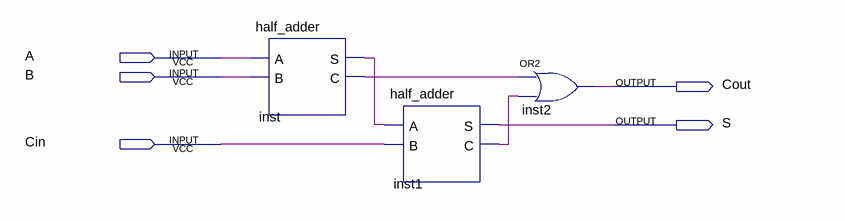
[diagram p0: schematic sheet]
// Quartus schematic full_adder.bdf as structural Verilog: 3 symbols, 5 pins
module full_adder (
  input  A,
  input  B,
  input  Cin,
  output Cout,
  output S
);

  wire inst1_c, inst_c, inst_s;

  half_adder inst (.A(A), .B(B), .S(inst_s), .C(inst_c));
  half_adder inst1 (.A(inst_s), .B(Cin), .S(S), .C(inst1_c));
  or inst2 (Cout, inst_c, inst1_c);
endmodule
